# Altium schematic sheet Power.SchDoc
size A4; PageSetup: Record=PageOptions嶤enterHorizontal=True嶤enterVertical=True嶱rintScale=0.98嶺Correction=1.00嶻Correction=1.00嶱rintKind=0嶣orderSize=5000000嶭eftOffset=0嶣ottomOffset=0嶰rientation=2嶱aperLength=1000嶱aperWidth=1000嶴cale=100嶱aperSource=7嶱rintQuality=-4嶮ediaType=1嶥itherType=10嶱aperKind=信纸嶱rintScaleMode=1
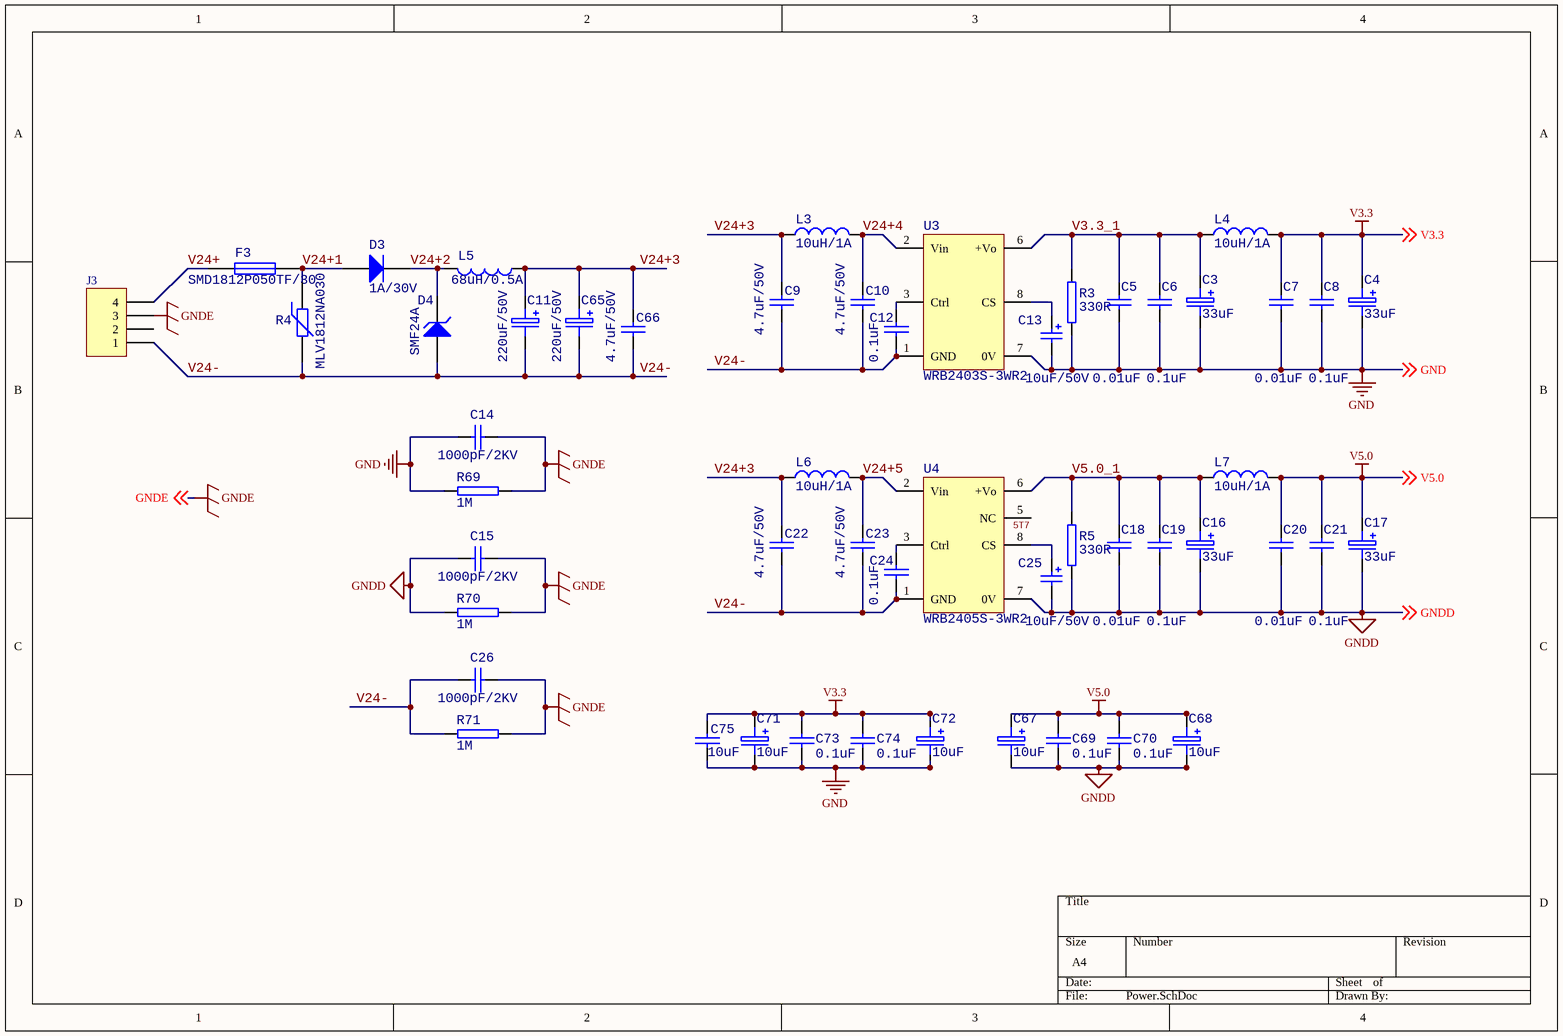
[diagram p0: Power.SchDoc]

## Parts
C3  33uF  [C3528(B)]
C4  33uF  [C3528(B)]
C5  0.01uF  [C1608(0603)]
C6  0.1uF  [C1608(0603)]
C7  0.01uF  [C1608(0603)]
C8  0.1uF  [C1608(0603)]
C9  4.7uF/50V  [C2012(0805)]
C10  4.7uF/50V  [C2012(0805)]
C11  220uF/50V  [CAPMP10X120]
C12  0.1uF  [C1608(0603)]
C13  10uF/50V  [C3216(1206)]
C14  1000pF/2KV  [C3216(1206)]
C15  1000pF/2KV  [C3216(1206)]
C16  33uF  [C3528(B)]
C17  33uF  [C3528(B)]
C18  0.01uF  [C1608(0603)]
C19  0.1uF  [C1608(0603)]
C20  0.01uF  [C1608(0603)]
C21  0.1uF  [C1608(0603)]
C22  4.7uF/50V  [C2012(0805)]
C23  4.7uF/50V  [C2012(0805)]
C24  0.1uF  [C1608(0603)]
C25  10uF/50V  [C3216(1206)]
C26  1000pF/2KV  [C3216(1206)]
C65  220uF/50V  [CAPMP10X120]
C66  4.7uF/50V  [C2012(0805)]
C67  10uF  [C3216(A)]
C68  10uF  [C3216(A)]
C69  0.1uF  [C1608(0603)]
C70  0.1uF  [C1608(0603)]
C71  10uF  [C3216(A)]
C72  10uF  [C3216(A)]
C73  0.1uF  [C1608(0603)]
C74  0.1uF  [C1608(0603)]
C75  10uF  [C2012(0805)]
D3  1A/30V  [SOD323]
D4  SMF24A  [SOD123]
F3  SMD1812P050TF/30  [R4532(1812)]
J3  Header 4  [MSTBO2.5/4-G1R]  (value not drawn)
L3  10uH/1A  [L4040]
L4  10uH/1A  [L4040]
L5  68uH/0.5A  [L4040]
L6  10uH/1A  [L4040]
L7  10uH/1A  [L4040]
R3  330R  [R3216(1206)]
R4  MLV1812NA030  [R4532(1812)]
R5  330R  [R3216(1206)]
R69  1M  [R3216(1206)]
R70  1M  [R3216(1206)]
R71  1M  [R3216(1206)]
U3  WRB2403S-3WR2  [SIP8]
U4  WRB2405S-3WR2  [SIP8]

## Nets
GND: C3.2 C4.2 C5.1 C6.1 C7.1 C8.1 C13.2 C14.1 C71.2 C72.2 C73.1 C74.1 C75.1 R3.2 R69.1 U3.7(0V) ; off-sheet GND
GNDD: C15.1 C16.2 C17.2 C18.1 C19.1 C20.1 C21.1 C25.2 C67.2 C68.2 C69.1 C70.1 R5.2 R70.1 U4.7(0V) ; off-sheet GNDD
GNDE: C14.2 C15.2 C26.2 J3.3 R69.2 R70.2 R71.2 ; off-sheet GNDE
V3.3: C4.1 C7.2 C8.2 C71.1 C72.1 C73.2 C74.2 C75.2 L4.2 ; off-sheet V3.3
V5.0: C17.1 C20.2 C21.2 C67.1 C68.1 C69.2 C70.2 L7.2 ; off-sheet V5.0
5T7: U4.5(NC)
V3.3_1: C3.1 C5.2 C6.2 L4.1 R3.1 U3.6(+Vo)
V5.0_1: C16.1 C18.2 C19.2 L7.1 R5.1 U4.6(+Vo)
V24+: F3.1 J3.4
V24+1: D3.1(A) F3.2 R4.1
V24+2: D3.2(K) D4.2(K) L5.2
V24+3: C9.2 C11.1 C22.2 C65.1 C66.2 L3.1 L5.1 L6.1
V24+4: C10.2 L3.2 U3.2(Vin)
V24+5: C23.2 L6.2 U4.2(Vin)
V24-: C9.1 C10.1 C11.2 C12.2 C22.1 C23.1 C24.2 C26.1 C65.2 C66.1 D4.1(A) J3.1 R4.2 R71.1 U3.1(GND) U4.1(GND)
NetC12_1: C12.1 U3.3(Ctrl)
NetC13_1: C13.1 U3.8(CS)
NetC24_1: C24.1 U4.3(Ctrl)
NetC25_1: C25.1 U4.8(CS)

Not connected (* = marked no-connect by the designer): J3 2; U3 5(NC)

## Library data of the parts
C3 C4 C11 C16 C17 C65 C67 C68 C71 C72 = CAPACITOR POL: CA45-?V?uF ABCD 16V10UF[A型3210]16V22UF(B型1210) 16V47UF(C型1812)
C5-C10 C12 C14 C15 C18-C24 C26 C66 C69 C70 C73-C75 = CAP: Capacitor
C13 C25 = Cap Pol2: Polarized Capacitor (Axial); Value: 100pF/100V; Published: 8-Jun-2000; LatestRevisionDate: 17-Jul-2002; LatestRevisionNote: Re-released for DXP Platform.; PackageReference: POLAR0.8; Publisher: Altium Limited
D3 = Diode: Default Diode; Published: 8-Jun-2000; LatestRevisionDate: 17-Jul-2002; LatestRevisionNote: Re-released for DXP Platform.; PackageVersion: Sep-1996; PackageReference: SMC; Publisher: Altium Limited; Code_JEDEC: DO-214-AB
D4 = D Zener: Zener Diode; Published: 8-Jun-2000; LatestRevisionDate: 17-Jul-2002; LatestRevisionNote: Re-released for DXP Platform.; PackageReference: DIODE-0.7; Publisher: Altium Limited
F3 = FUSE1: Fuse
J3 = Header 4: Header, 4-Pin; LatestRevisionDate: 17-Jul-2002; LatestRevisionNote: Re-released for DXP Platform.; Publisher: Altium Limited
L3 L4 L6 L7 = Inductor: Code_IEC: 1005; Value: ABRACON; Published: 8-Jun-2000; LatestRevisionDate: 29-May-2009; LatestRevisionNote: IPC-7351 Footprint Added.; PackageReference: 0402-A; Publisher: Altium Limited; PackageDescription: Chip Inductor; Code_JEITA: 0402
L5 = Inductor: Code_IEC: 1005; Value: SRN4018-680M/CD32-680K; Published: 8-Jun-2000; LatestRevisionDate: 29-May-2009; LatestRevisionNote: IPC-7351 Footprint Added.; PackageReference: 0402-A; Publisher: Altium Limited; PackageDescription: Chip Inductor; Code_JEITA: 0402
R3 R5 R69-R71 = R
R4 = Res Varistor: Varistor (Voltage-Sensitive Resistor); Published: 24-Mar-1999; LatestRevisionDate: 29-May-2009; LatestRevisionNote: IPC-7351 Footprint Added.; PackageVersion: Mar-2003; PackageReference: 6-0805; Publisher: Altium Limited; PackageDescription: Chip Resistor 0805 Case Size; Code_IPC: RESC2012
U3 U4 = WRA_S-1WR2